# Altium schematic sheet Connector.SchDoc
size A3; SheetNumber: 16; SheetTotal: 26
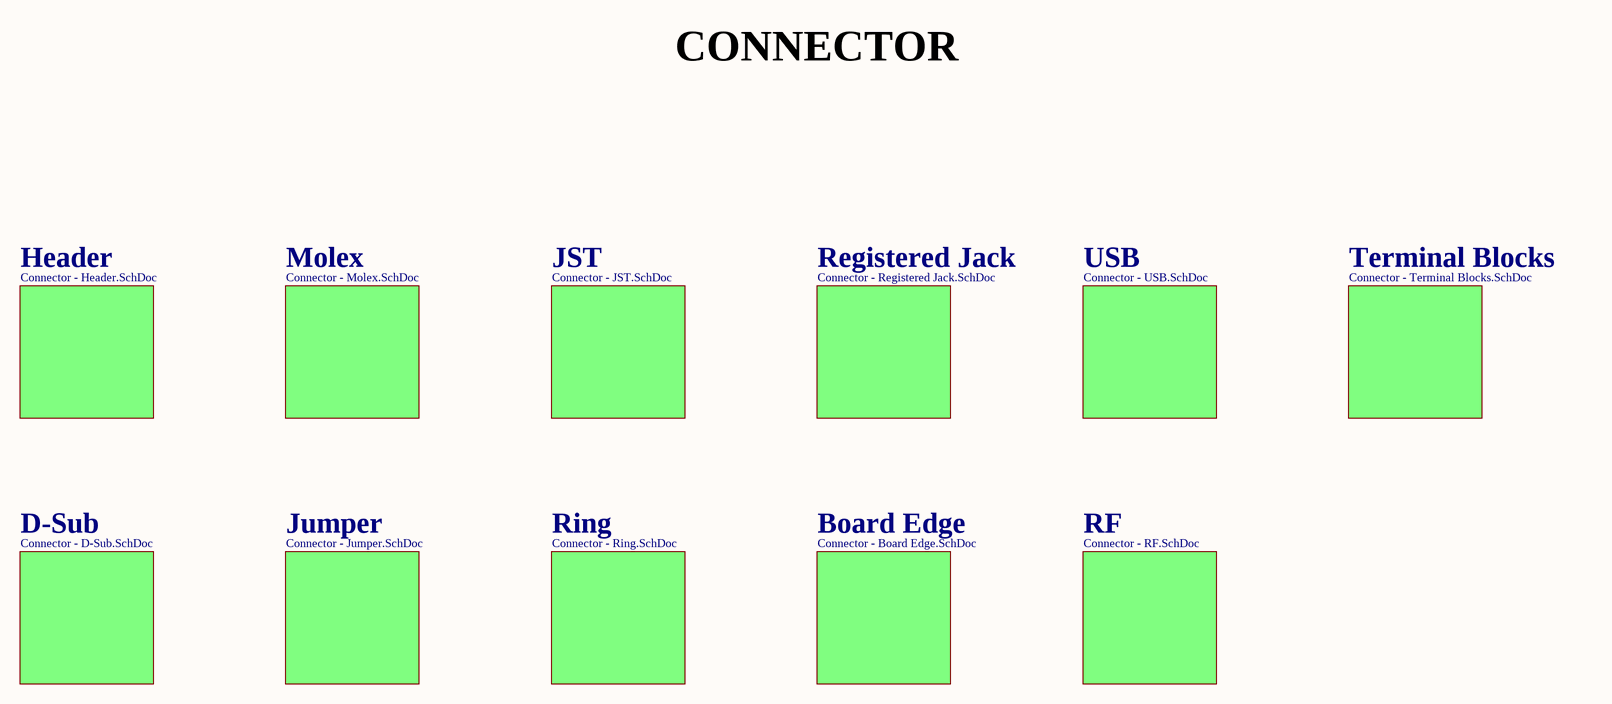
[diagram p0: Connector.SchDoc]

## Sub-sheets
Board Edge = Connector - Board Edge.SchDoc: no entries
D-Sub = Connector - D-Sub.SchDoc: no entries
Header = Connector - Header.SchDoc: no entries
JST = Connector - JST.SchDoc: no entries
Jumper = Connector - Jumper.SchDoc: no entries
Molex = Connector - Molex.SchDoc: no entries
Registered Jack = Connector - Registered Jack.SchDoc: no entries
RF = Connector - RF.SchDoc: no entries
Ring = Connector - Ring.SchDoc: no entries
Terminal Blocks = Connector - Terminal Blocks.SchDoc: no entries
USB = Connector - USB.SchDoc: no entries

## Notes on the sheet
- CONNECTOR